# EAGLE design led-panel (EAGLE 9.6.0)

## Sheet 1 of 4
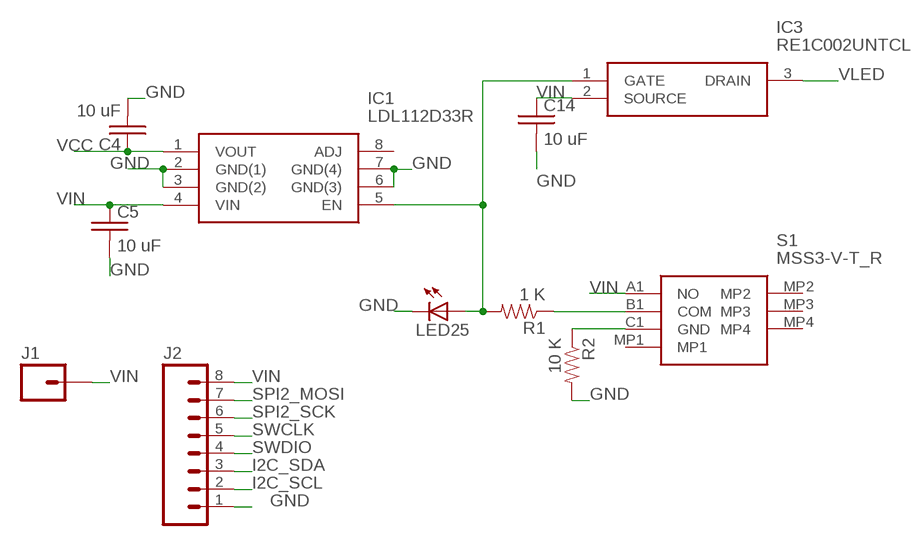
[diagram p0: schematic, sheet 1]

### Parts
C4  10 uF  C-USC0805K  [C0805K]
C5  10 uF  C-USC0805K  [C0805K]
C14  10 uF  C-USC0805K  [C0805K]
IC1  LDL112D33R  [SOIC127P600X175-8N]
IC3  RE1C002UNTCL  [SOT50P160X85-3N]
J1  M01HVIA  [HOME_VIA]
J2  M08LONGPADS  [1X08_LONGPADS]
LED25  LEDXZCFBB53W-8VF-2MA-LED  [LEDC1606X95N]
R1  1 K  RESISTORR0805-RES  [R0805]
R2  10 K  RESISTORR0805-RES  [R0805]
S1  MSS3-V-T_R  [MSS3VTR]

### Nets
GND: C4.2 C5.2 C14.2 IC1.2(GND(1)) IC1.3(GND(2)) IC1.6(GND(3)) IC1.7(GND(4)) J2.1 LED25.2(C) R2.2 ; also sheet 2,3
I2C_SCL: J2.2 ; also sheet 2
I2C_SDA: J2.3 ; also sheet 2
N$9: R2.1 S1.C1(GND)
N$15: R1.1 S1.B1(COM)
N$17: IC1.5(EN) IC3.1(GATE) LED25.1(A) R1.2
SPI2_MOSI: J2.7 ; also sheet 2,3
SPI2_SCK: J2.6 ; also sheet 2,3
SWCLK: J2.5 ; also sheet 2
SWDIO: J2.4 ; also sheet 2
VCC: C4.1 IC1.1(VOUT) ; also sheet 2
VIN: C5.1 C14.1 IC1.4(VIN) IC3.2(SOURCE) J1.1 J2.8 S1.A1(NO)
VLED: IC3.3(DRAIN) ; also sheet 3
Unconnected: IC1.8(ADJ) S1.MP1 S1.MP2 S1.MP3 S1.MP4

## Sheet 2 of 4
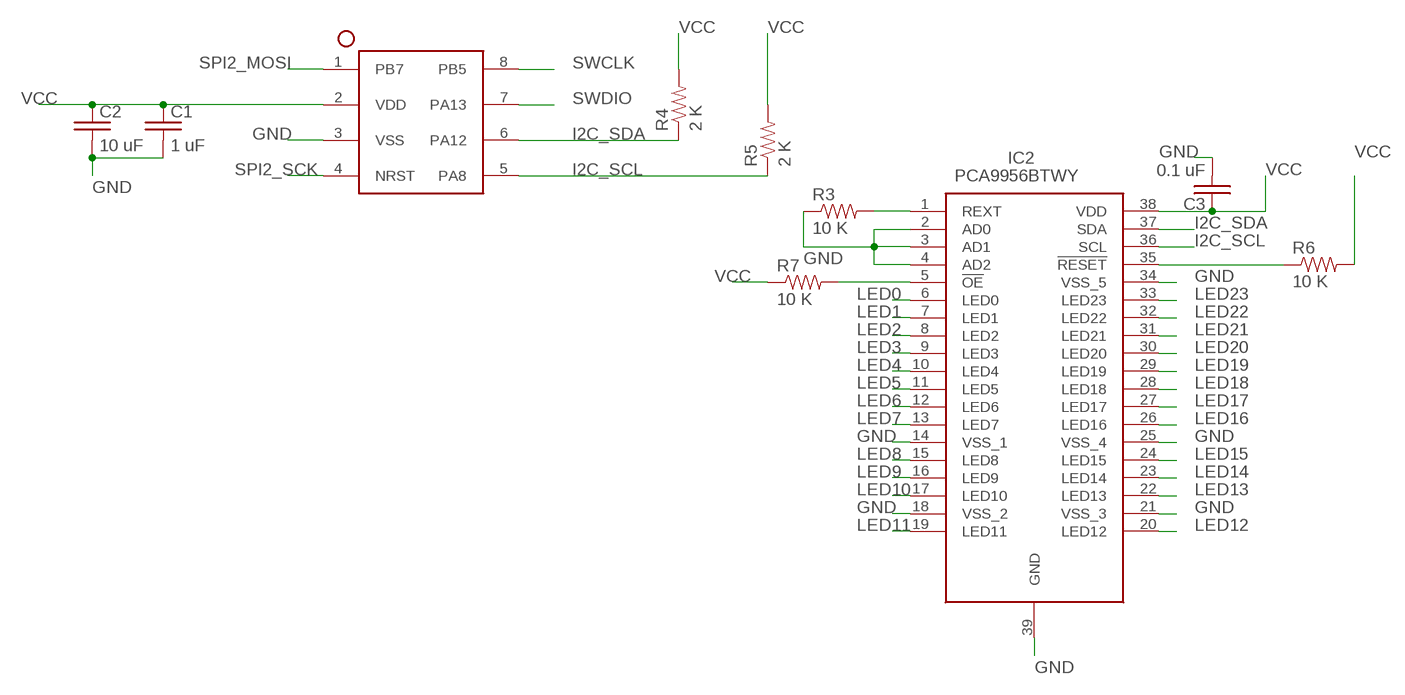
[diagram p1: schematic, sheet 2]

### Parts
C1  1 uF  C-USC0805K  [C0805K]
C2  10 uF  C-USC0805K  [C0805K]
C3  0.1 uF  C-USC0805K  [C0805K]
IC2  PCA9956BTWY  [SOP50P640X110-39N]
R3  10 K  RESISTOR0805-RES  [0805]
R4  2 K  RESISTOR0805-RES  [0805]
R5  2 K  RESISTOR0805-RES  [0805]
R6  10 K  RESISTOR0805-RES  [0805]
R7  10 K  RESISTOR0805-RES  [0805]
U$1  STM32G031S08N  [SOIC127P600X175-8N]

### Nets
GND: C1.2 C2.2 C3.2 IC2.2(AD0) IC2.3(AD1) IC2.4(AD2) IC2.14(VSS_1) IC2.18(VSS_2) IC2.21(VSS_3) IC2.25(VSS_4) IC2.34(VSS_5) IC2.39(GND) R3.1 U$1.3(VSS) ; also sheet 1,3
I2C_SCL: IC2.36(SCL) R5.1 U$1.5(PA8) ; also sheet 1
I2C_SDA: IC2.37(SDA) R4.1 U$1.6(PA12) ; also sheet 1
LED0: IC2.6(LED0) ; also sheet 3
LED1: IC2.7(LED1) ; also sheet 3
LED2: IC2.8(LED2) ; also sheet 3
LED3: IC2.9(LED3) ; also sheet 3
LED4: IC2.10(LED4) ; also sheet 3
LED5: IC2.11(LED5) ; also sheet 3
LED6: IC2.12(LED6) ; also sheet 3
LED7: IC2.13(LED7) ; also sheet 3
LED8: IC2.15(LED8) ; also sheet 3
LED9: IC2.16(LED9) ; also sheet 3
LED10: IC2.17(LED10) ; also sheet 3
LED11: IC2.19(LED11) ; also sheet 3
LED12: IC2.20(LED12) ; also sheet 3
LED13: IC2.22(LED13) ; also sheet 3
LED14: IC2.23(LED14) ; also sheet 3
LED15: IC2.24(LED15) ; also sheet 3
LED16: IC2.26(LED16) ; also sheet 3
LED17: IC2.27(LED17) ; also sheet 3
LED18: IC2.28(LED18) ; also sheet 3
LED19: IC2.29(LED19) ; also sheet 3
LED20: IC2.30(LED20) ; also sheet 3
LED21: IC2.31(LED21) ; also sheet 3
LED22: IC2.32(LED22) ; also sheet 3
LED23: IC2.33(LED23) ; also sheet 3
N$11: IC2.1(REXT) R3.2
N$12: IC2.5(!OE) R7.2
N$44: IC2.35(!RESET) R6.1
SPI2_MOSI: U$1.1(PB7) ; also sheet 1,3
SPI2_SCK: U$1.4(NRST) ; also sheet 1,3
SWCLK: U$1.8(PB5) ; also sheet 1
SWDIO: U$1.7(PA13) ; also sheet 1
VCC: C1.1 C2.1 C3.1 IC2.38(VDD) R4.2 R5.2 R6.2 R7.1 U$1.2(VDD) ; also sheet 1

## Sheet 3 of 4
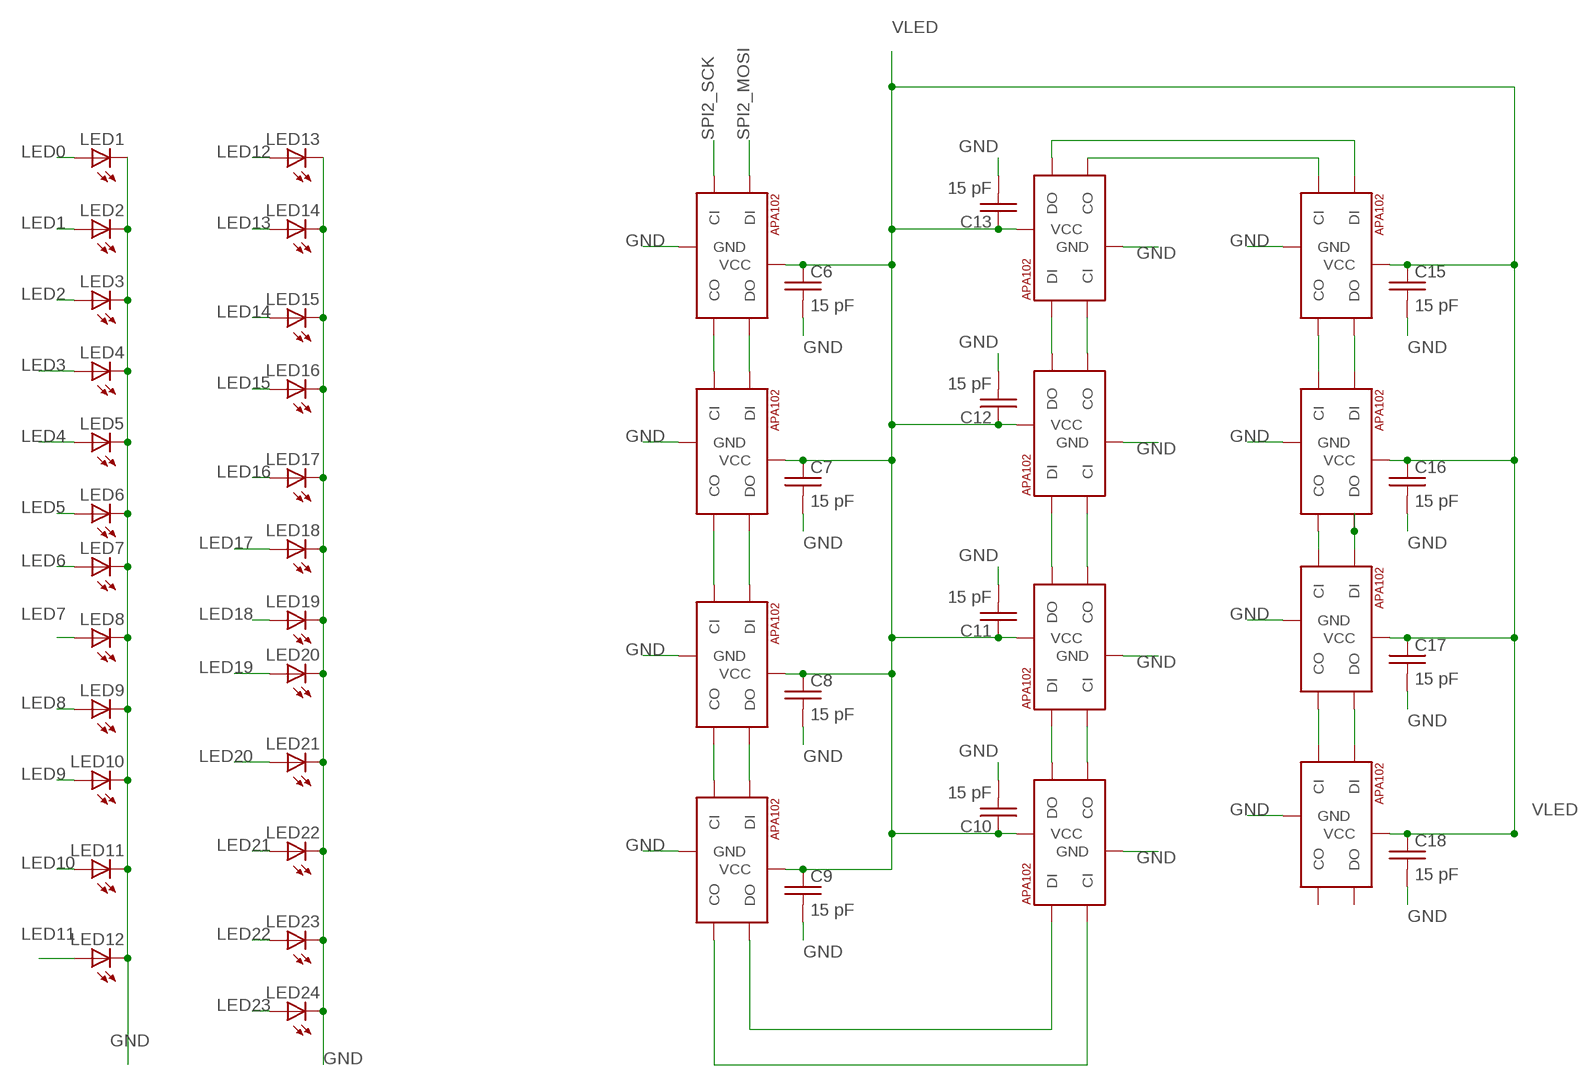
[diagram p2: schematic, sheet 3]

### Parts
C6  15 pF  C-USC0805K  [C0805K]
C7  15 pF  C-USC0805K  [C0805K]
C8  15 pF  C-USC0805K  [C0805K]
C9  15 pF  C-USC0805K  [C0805K]
C10  15 pF  C-USC0805K  [C0805K]
C11  15 pF  C-USC0805K  [C0805K]
C12  15 pF  C-USC0805K  [C0805K]
C13  15 pF  C-USC0805K  [C0805K]
C15  15 pF  C-USC0805K  [C0805K]
C16  15 pF  C-USC0805K  [C0805K]
C17  15 pF  C-USC0805K  [C0805K]
C18  15 pF  C-USC0805K  [C0805K]
LED1  LEDXZCFBB53W-8VF-2MA-LED  [LEDC1606X95N]
LED2  LEDXZCFBB53W-8VF-2MA-LED  [LEDC1606X95N]
LED3  LEDXZCFBB53W-8VF-2MA-LED  [LEDC1606X95N]
LED4  LEDXZCFBB53W-8VF-2MA-LED  [LEDC1606X95N]
LED5  LEDXZCFBB53W-8VF-2MA-LED  [LEDC1606X95N]
LED6  LEDXZCFBB53W-8VF-2MA-LED  [LEDC1606X95N]
LED7  LEDXZCFBB53W-8VF-2MA-LED  [LEDC1606X95N]
LED8  LEDXZCFBB53W-8VF-2MA-LED  [LEDC1606X95N]
LED9  LEDXZCFBB53W-8VF-2MA-LED  [LEDC1606X95N]
LED10  LEDXZCFBB53W-8VF-2MA-LED  [LEDC1606X95N]
LED11  LEDXZCFBB53W-8VF-2MA-LED  [LEDC1606X95N]
LED12  LEDXZCFBB53W-8VF-2MA-LED  [LEDC1606X95N]
LED13  LEDXZCFBB53W-8VF-2MA-LED  [LEDC1606X95N]
LED14  LEDXZCFBB53W-8VF-2MA-LED  [LEDC1606X95N]
LED15  LEDXZCFBB53W-8VF-2MA-LED  [LEDC1606X95N]
LED16  LEDXZCFBB53W-8VF-2MA-LED  [LEDC1606X95N]
LED17  LEDXZCFBB53W-8VF-2MA-LED  [LEDC1606X95N]
LED18  LEDXZCFBB53W-8VF-2MA-LED  [LEDC1606X95N]
LED19  LEDXZCFBB53W-8VF-2MA-LED  [LEDC1606X95N]
LED20  LEDXZCFBB53W-8VF-2MA-LED  [LEDC1606X95N]
LED21  LEDXZCFBB53W-8VF-2MA-LED  [LEDC1606X95N]
LED22  LEDXZCFBB53W-8VF-2MA-LED  [LEDC1606X95N]
LED23  LEDXZCFBB53W-8VF-2MA-LED  [LEDC1606X95N]
LED24  LEDXZCFBB53W-8VF-2MA-LED  [LEDC1606X95N]
U$2  APA1025050  [APA102_5050]
U$4  APA1025050  [APA102_5050]
U$5  APA1025050  [APA102_5050]
U$6  APA1025050  [APA102_5050]
U$7  APA1025050  [APA102_5050]
U$8  APA1025050  [APA102_5050]
U$9  APA1025050  [APA102_5050]
U$10  APA1025050  [APA102_5050]
U$11  APA1025050  [APA102_5050]
U$12  APA1025050  [APA102_5050]
U$13  APA1025050  [APA102_5050]
U$14  APA1025050  [APA102_5050]

### Nets
GND: C6.2 C7.2 C8.2 C9.2 C10.2 C11.2 C12.2 C13.2 C15.2 C16.2 C17.2 C18.2 LED1.2(C) LED2.2(C) LED3.2(C) LED4.2(C) LED5.2(C) LED6.2(C) LED7.2(C) LED8.2(C) LED9.2(C) LED10.2(C) LED11.2(C) LED12.2(C) LED13.2(C) LED14.2(C) LED15.2(C) LED16.2(C) LED17.2(C) LED18.2(C) LED19.2(C) LED20.2(C) LED21.2(C) LED22.2(C) LED23.2(C) LED24.2(C) U$2.6(GND) U$4.6(GND) U$5.6(GND) U$6.6(GND) U$7.6(GND) U$8.6(GND) U$9.6(GND) U$10.6(GND) U$11.6(GND) U$12.6(GND) U$13.6(GND) U$14.6(GND) ; also sheet 1,2
LED0: LED1.1(A) ; also sheet 2
LED1: LED2.1(A) ; also sheet 2
LED2: LED3.1(A) ; also sheet 2
LED3: LED4.1(A) ; also sheet 2
LED4: LED5.1(A) ; also sheet 2
LED5: LED6.1(A) ; also sheet 2
LED6: LED7.1(A) ; also sheet 2
LED7: LED8.1(A) ; also sheet 2
LED8: LED9.1(A) ; also sheet 2
LED9: LED10.1(A) ; also sheet 2
LED10: LED11.1(A) ; also sheet 2
LED11: LED12.1(A) ; also sheet 2
LED12: LED13.1(A) ; also sheet 2
LED13: LED14.1(A) ; also sheet 2
LED14: LED15.1(A) ; also sheet 2
LED15: LED16.1(A) ; also sheet 2
LED16: LED17.1(A) ; also sheet 2
LED17: LED18.1(A) ; also sheet 2
LED18: LED19.1(A) ; also sheet 2
LED19: LED20.1(A) ; also sheet 2
LED20: LED21.1(A) ; also sheet 2
LED21: LED22.1(A) ; also sheet 2
LED22: LED23.1(A) ; also sheet 2
LED23: LED24.1(A) ; also sheet 2
N$1: U$2.2(CO) U$4.5(CI)
N$2: U$2.3(DO) U$4.4(DI)
N$3: U$4.2(CO) U$5.5(CI)
N$4: U$4.3(DO) U$5.4(DI)
N$5: U$5.3(DO) U$6.4(DI)
N$6: U$5.2(CO) U$6.5(CI)
N$7: U$6.3(DO) U$7.4(DI)
N$8: U$6.2(CO) U$7.5(CI)
N$10: U$7.3(DO) U$8.4(DI)
N$13: U$7.2(CO) U$8.5(CI)
N$14: U$8.3(DO) U$9.4(DI)
N$16: U$8.2(CO) U$9.5(CI)
N$18: U$9.2(CO) U$10.5(CI)
N$19: U$9.3(DO) U$10.4(DI)
N$20: U$11.3(DO) U$12.4(DI)
N$21: U$11.2(CO) U$12.5(CI)
N$22: U$13.3(DO) U$14.4(DI)
N$23: U$13.2(CO) U$14.5(CI)
N$24: U$12.2(CO) U$13.5(CI)
N$25: U$12.3(DO) U$13.4(DI)
N$26: U$10.2(CO) U$11.5(CI)
N$27: U$10.3(DO) U$11.4(DI)
SPI2_MOSI: U$2.4(DI) ; also sheet 1,2
SPI2_SCK: U$2.5(CI) ; also sheet 1,2
VLED: C6.1 C7.1 C8.1 C9.1 C10.1 C11.1 C12.1 C13.1 C15.1 C16.1 C17.1 C18.1 U$2.1(VCC) U$4.1(VCC) U$5.1(VCC) U$6.1(VCC) U$7.1(VCC) U$8.1(VCC) U$9.1(VCC) U$10.1(VCC) U$11.1(VCC) U$12.1(VCC) U$13.1(VCC) U$14.1(VCC) ; also sheet 1
Unconnected: U$14.2(CO) U$14.3(DO)

## Sheet 4 of 4
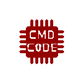
[diagram p3: schematic, sheet 4]

### Parts
U$3  CMD_C0DE_LOGOCMD_CODE_LOGO_TOP_COPPER  [CMD_C0DE_LOGO_TOP_COPPER]

## Library data of the parts
C1-C18 = passives:C-US: CAPACITOR, American symbol
IC1 = voltage-regulator:LDL112D33R: LDO Voltage Regulators 1.2 A low quiescent current LDO with reverse current protection Source: Datasheet <https://www.arrow.com/en/products/ldl112d33r/stmicroelectronics>; ARROW_PART_NUMBER: LDL112D33R; ARROW_PRICE/STOCK: https://www.arrow.com/en/products/ldl112d33r/stmicroelectronics; DESCRIPTION: LDO Voltage Regulators 1.2 A low quiescent current LDO with reverse current protection; HEIGHT: 1.75mm; MANUFACTURER_NAME: STMicroelectronics; MANUFACTURER_PART_NUMBER: LDL112D33R
IC2 = leds:PCA9956BTWY: NXP - PCA9956BTWY - LED DRIVER, CONSTANT CURRENT, HTSSOP-38 Source: Datasheet <https://www.mouser.be/datasheet/2/302/PCA9956B-1127643.pdf>; DESCRIPTION: NXP - PCA9956BTWY - LED DRIVER, CONSTANT CURRENT, HTSSOP-38; HEIGHT: 1.1mm; MANUFACTURER_NAME: NXP; MANUFACTURER_PART_NUMBER: PCA9956BTWY; MOUSER_PART_NUMBER: 771-PCA9956BTWY
IC3 = transitors:RE1C002UNTCL: MOSFET 1.2V Drive Nch MOSFET Source: Datasheet <https://componentsearchengine.com/Datasheets/1/RE1C002UNTCL.pdf>; DESCRIPTION: MOSFET 1.2V Drive Nch MOSFET; HEIGHT: 0.85mm; MANUFACTURER_NAME: ROHM Semiconductor; MANUFACTURER_PART_NUMBER: RE1C002UNTCL; MOUSER_PART_NUMBER: 755-RE1C002UNTCL; MOUSER_PRICE-STOCK: https://www.mouser.com/Search/Refine.aspx?Keyword=755-RE1C002UNTCL
J1 = connector:M01: Header 1 Standard 1-pin 0.1" header. Use with straight break away headers (SKU : PRT-00116), right angle break away headers (PRT-00553), swiss pins (PRT-00743), machine pins (PRT-00117), and female headers (PRT-00115). SMTSO-256-ET is a "flush mount" nut for a 4-40 screw. The older package used to be too tight, and did not allow it to sit properly thru the drill hit. The latest (0.165DIA) fits nice and snug.
J2 = connector:M08: Header 8 Standard 8-pin 0.1" header. Use with straight break away headers (SKU : PRT-00116), right angle break away headers (PRT-00553), swiss pins (PRT-00743), machine pins (PRT-00117), and female headers (PRT-00115).
LED1-LED25 = leds:LED: LEDs Standard schematic elements and footprints for 5mm, 3mm, 1206, and 0603 sized LEDs. 5mm - Spark Fun Electronics SKU : COM-00529 (and others)
R1-R7 = passives:RESISTOR: Resistor Basic schematic elements and footprints for 0603, 1206, and PTH resistors.
S1 = switches:MSS3-V-T_R: Slide Switches Slide Type 1P2T (1.4mm height) Source: Datasheet <http://www.dip.com.tw/en/en-product-information/en-switch005/item/download/2643_3624e6da26abd0f9c3465d69564276ea>; DESCRIPTION: Slide Switches Slide Type 1P2T (1.4mm height); HEIGHT: 1.4mm; MANUFACTURER_NAME: Diptronics; MANUFACTURER_PART_NUMBER: MSS3-V-T/R; MOUSER_PART_NUMBER: 113-MSS3-V-T/R; MOUSER_PRICE-STOCK: https://www.mouser.com/Search/Refine.aspx?Keyword=113-MSS3-V-T%2FR
U$1 = ICs:STM32G031
U$2 U$4-U$14 = leds:APA102: APA102C 5050 RGB LED -- Adafruit DotStar Single LED Pixel Product Page: https://www.adafruit.com/products/2343 Datasheet: https://cdn-shop.adafruit.com/product-files/2343/APA102C.pdf
U$3 = logos:CMD_C0DE_LOGO

## Board
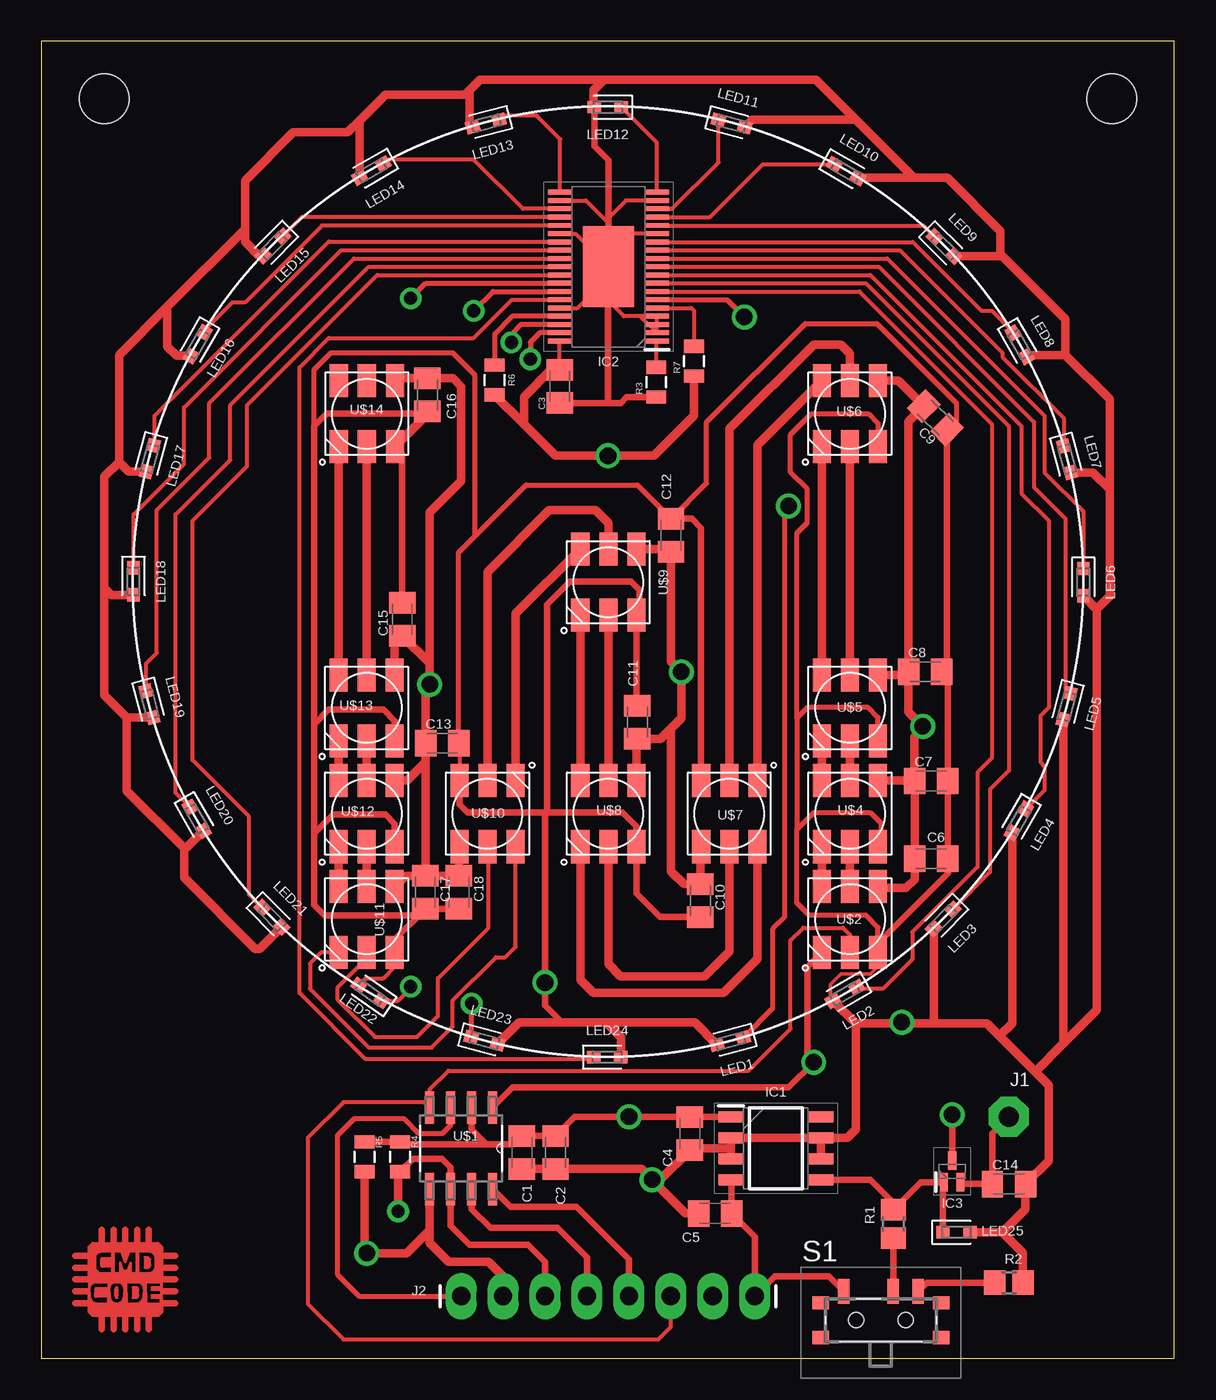
[diagram p4: board, top side]
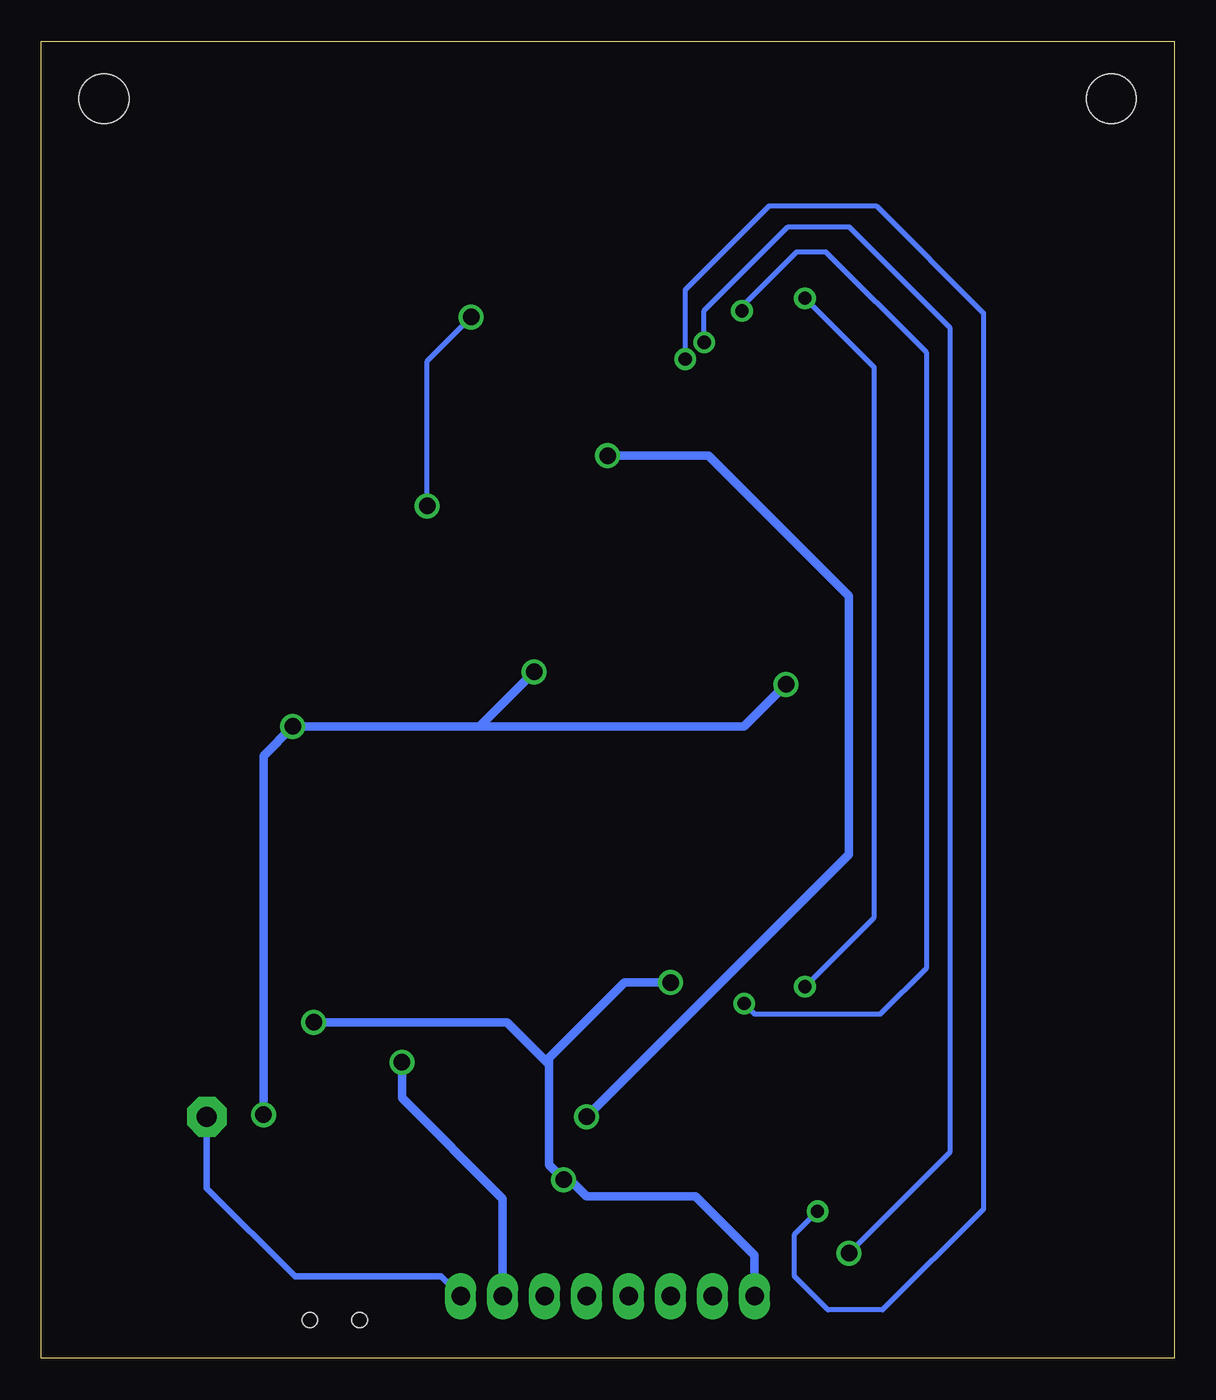
[diagram p5: board, bottom side, seen from below]

Size 68.56 x 79.68 mm. Coordinates in mm from the lower left corner, seen from the top.
Outline: 0,0 68.56,0 68.56,79.68 0,79.68 0,0
Copper layers (1*16): Top 0.035mm / dielectric 1.5mm / Bottom 0.035mm
Design rules "OthermillDRC_30_deg_v2": minimum track width 6mil, minimum drill 0.8mm, track to track 6mil, track to pad 6mil, pad to pad 6mil, via to via 6mil, smd to smd 0mil, copper to edge 0mil, drill to drill 6mil, minimum pad ring 10mil, minimum via ring 10mil, stop-mask expansion 1mil, vias tented up to drill 30mil, thermal gap 6mil
Holes 3 mm at 3.81,76.2 64.77,76.2

### Footprints (pad centres in the part's own frame; a part is rotated, then mirrored left to right if it is on the bottom)
C0805K = smd 1.3 x 1.6: 1 -1,0; 2 1,0
SOIC127P600X175-8N = smd 1.525 x 0.65: 1 -2.712,1.905; 2 -2.712,0.635; 3 -2.712,-0.635; 4 -2.712,-1.905; 5 2.712,-1.905; 6 2.712,-0.635; 7 2.712,0.635; 8 2.712,1.905
SOP50P640X110-39N = smd 1.45 x 0.3: 1 -2.925,4.5; 2 -2.925,4; 3 -2.925,3.5; 4 -2.925,3; 5 -2.925,2.5; 6 -2.925,2; 7 -2.925,1.5; 8 -2.925,1; 9 -2.925,0.5; 10 -2.925,0; 11 -2.925,-0.5; 12 -2.925,-1; 13 -2.925,-1.5; 14 -2.925,-2; 15 -2.925,-2.5; 16 -2.925,-3; 17 -2.925,-3.5; 18 -2.925,-4; 19 -2.925,-4.5; 20 2.925,-4.5; 21 2.925,-4; 22 2.925,-3.5; 23 2.925,-3; 24 2.925,-2.5; 25 2.925,-2; 26 2.925,-1.5; 27 2.925,-1; 28 2.925,-0.5; 29 2.925,0; 30 2.925,0.5; 31 2.925,1; 32 2.925,1.5; 33 2.925,2; 34 2.925,2.5; 35 2.925,3; 36 2.925,3.5; 37 2.925,4; 38 2.925,4.5 | smd 3.1 x 4.9: 39 0,0
SOT50P160X85-3N = smd 1.1 x 0.5: 1 -0.65,0.5; 2 -0.65,-0.5; 3 0.65,0
HOME_VIA = drill 1.2 pad 2.4 octagon: 1 0,0
1X08_LONGPADS = drill 1.118 pad 1.88 long: 1 0,0; 2 2.54,0; 3 5.08,0; 4 7.62,0; 5 10.16,0; 6 12.7,0; 7 15.24,0; 8 17.78,0
LEDC1606X95N = smd 0.81 x 0.75: 1 -0.82,0; 2 0.82,0
R0805 = smd 1.3 x 1.5: 1 -0.85,0; 2 0.85,0
0805 = smd 0.8 x 1.2: 1 -0.9,0; 2 0.9,0
MSS3VTR = smd 0.7 x 1.5: A1 -2.25,3.05; B1 0.75,3.05; C1 2.25,3.05 | smd 1 x 0.8: MP1 -3.65,2.35; MP2 -3.65,0.25; MP3 3.65,0.25; MP4 3.65,2.35 | hole 0.9: -1.5,1.3; 1.5,1.3
SOIC127P600X175-8N' = smd 1.981 x 0.559: 1 -2.464,1.905; 2 -2.464,0.635; 3 -2.464,-0.635; 4 -2.464,-1.905; 5 2.464,-1.905; 6 2.464,-0.635; 7 2.464,0.635; 8 2.464,1.905
APA102_5050 = smd 2 x 1.1: 1 2,-1.7; 2 2,0; 3 2,1.7; 4 -2,1.7; 5 -2,0; 6 -2,-1.7

### Placement (x,y rotation side)
C1  29.08,12.45 270 top
C2  31.11,12.45 270 top
C3  31.37,58.8 270 top
C4  39.24,13.59 270 top
C5  40.77,8.76 180 top
C6  53.85,30.23 0 top
C7  53.85,34.92 0 top
C8  53.47,41.53 0 top
C9  54.1,56.9 315 top
C10  39.88,27.69 270 top
C11  36.07,38.48 90 top
C12  38.1,49.78 90 top
C13  24.26,37.21 0 top
C14  58.55,10.54 0 top
C15  21.84,44.7 90 top
C16  23.37,58.29 270 top
C17  23.24,28.19 270 top
C18  25.27,28.19 270 top
IC1  44.45,12.7 0 top
IC2  34.31,66.04 180 top
IC3  55.12,11.3 90 top
J1  58.55,14.61 0 top
J2  25.4,3.75 0 top
LED1  41.68,19.18 195 top
LED2  48.62,22.03 210 top
LED3  54.58,26.58 225 top
LED4  59.16,32.52 240 top
LED5  62.05,39.44 255 top
LED6  63.05,46.96 270 top
LED7  62.07,54.39 285 top
LED8  59.2,61.32 300 top
LED9  54.64,67.27 315 top
LED10  48.7,71.83 330 top
LED11  41.77,74.7 345 top
LED12  34.28,75.69 180 top
LED13  26.9,74.72 195 top
LED14  19.97,71.86 210 top
LED15  14.02,67.3 225 top
LED16  9.45,61.36 240 top
LED17  6.57,54.43 255 top
LED18  5.58,47 270 top
LED19  6.55,39.57 285 top
LED20  9.4,32.63 300 top
LED21  13.96,26.67 315 top
LED22  19.89,22.1 145 top
LED23  26.82,19.22 345 top
LED24  34.25,18.22 0 top
LED25  55.37,7.62 0 top
R1  51.56,8.13 90 top
R2  58.55,4.57 0 top
R3  37.21,59.05 90 top
R4  21.72,12.19 90 top
R5  19.56,12.19 90 top
R6  27.43,59.18 270 top
R7  39.5,60.33 90 top
S1  50.8,1 0 top
U$1  STM32G031S08N  [SOIC127P600X175-8N']  25.4,12.7 270 top
U$2  48.93,26.55 90 top
U$3  5.08,5.08 0 top
U$4  48.93,32.95 90 top
U$5  48.93,39.34 90 top
U$6  48.93,57.15 90 top
U$7  41.63,32.95 270 top
U$8  34.31,32.95 90 top
U$9  34.31,46.96 90 top
U$10  27,32.95 270 top
U$11  19.68,26.55 90 top
U$12  19.68,32.95 90 top
U$13  19.68,39.34 90 top
U$14  19.7,57.15 90 top

### Tracks (layer width: path | path; a pad name or v marks a point on that pad's centre or on a via)
GND  (via drill 1)
  Top 0.2: LED2.2 47.75,21.78 47.75,22.61 48.39,23.24 49.45,23.24 49.46,23.24 50.16,23.24 50.63,23.71 U$2.6
  Top 0.254: 36.24,63.04 IC2.4 IC2.3 IC2.2 36.24,63.04 | 36.24,63.04 35.26,63.04 34.31,63.98 34.31,65.02 34.31,65.41 | 34.31,65.41 IC2.39 | IC2.34 32.45,63.54 34.31,65.41 | IC2.25 32.31,68.04 IC2.39 | IC2.14 35.59,68.04 35.56,68.07 34.31,66.83 IC2.39 | IC2.21 32.96,70.04 34.31,68.68 | 34.31,68.68 IC2.39 | IC2.18 35.37,70.04 34.31,68.99 34.31,68.68 | 50.8,31.12 U$4.6 | C11.2 36.02,39.53 | U$9.6 36.02,44.83 36.2,45.01 | C17.2 22.84,26.8 | 23.34,57.15 23.37,57.12 | C13.2 25.3,37.17 U$10.6 | 38.12,50.8 C12.2 | 30.61,33.15 30.48,33.02 | LED22.2 19.64,22.99 20.7,22.99 21.39,23.67 U$11.6
  Top 0.305: U$2.6 50.63,26.08 49.91,26.8 46.48,26.8 45.72,27.56 45.72,32 | 45.72,32 46.74,33.02 50.16,33.02 50.8,32.38 50.8,31.12 | U$5.6 50.63,38.78 50.04,39.37 46.35,39.37 45.72,38.73 | 45.72,38.73 45.72,32 | 45.72,38.73 45.72,49.91 46.35,50.55 46.35,52.58 45.34,53.59 45.34,55.88 46.61,57.15 50.04,57.15 50.63,56.56 U$6.6 | U$1.3 24.77,14.1 24.26,13.59 22.86,13.59 21.97,14.48 18.92,14.48 17.91,13.46 17.91,5.08 19.24,3.75 J2.1 | C13.2 25.26,48.75 26.23,49.72 | 26.23,49.72 29.34,52.83 36.07,52.83 38.1,50.8 C12.2 40.26,52.94 40.26,56.64 46.23,62.61 50.55,62.61 55.37,57.78 55.37,56.75 C9.2 | 16.51,56.39 16.51,59.82 17.53,60.83 24.89,60.83 26.23,59.5 26.23,49.72
  Top 0.406: C9.2 54.81,41.87 C8.2 54.85,41.15 C7.2 C6.2 54.85,29.32 50.63,25.1 U$2.6 | C3.2 34.29,57.8 | 34.29,57.8 35.07,57.8 35.42,58.16 R3.1 | 34.29,57.8 34.29,65 34.31,65.02 | C10.2 37.45,26.69 36.02,28.12 U$8.6 36.02,32.18 35.18,33.02 30.48,33.02 | 36.02,39.53 36.02,44.83 | C18.2 C17.2 21.39,25.34 U$11.6 | 22.84,26.8 17.14,26.8 16.51,27.43 16.51,31.75 | U$12.6 21.39,32.34 20.83,32.89 17.65,32.89 16.51,31.75 | 16.51,31.75 16.51,38.35 | 16.51,38.35 17.4,39.24 20.7,39.24 21.39,38.56 U$13.6 | 16.51,38.35 16.51,56.39 17.27,57.15 23.34,57.15 | C15.2 21.84,54.71 U$14.6 | U$10.6 25.3,33.5 25.78,33.02 30.48,33.02 | U$7.6 39.93,50.24 39.37,50.8 38.12,50.8 | 36.2,45.01 36.2,46.48 35.69,46.99 32,46.99 30.61,45.59 30.61,33.15 | IC2.39 34.31,72.49 33.46,73.35 LED12.2 | 30.48,33.02 30.48,21.34 31.5,20.32
  Top 0.508: C1.2 C2.2 36.31,11.45 v36.96,10.79 | IC1.3 41.74,12.7 | 41.74,12.7 IC1.2 IC1.7 | 41.74,12.7 39.35,12.7 C4.2 37.45,10.79 v36.96,10.79 | IC1.6 IC1.7 | IC1.7 48.77,13.34 49.28,13.84 49.28,20.25 | 49.28,20.25 LED2.2 | LED25.2 58.17,7.62 | R2.2 59.4,6.39 58.17,7.62 | 58.17,7.62 59.55,9 C14.2 60.96,11.95 60.96,16.51 60.13,17.34 | 60.13,17.34 57.98,19.49 | 57.98,19.49 57.22,20.25 53.85,20.25 | 53.85,20.25 49.28,20.25 | LED3.2 54,20.4 53.85,20.25 | LED4.2 58.75,20.27 57.98,19.49 | LED5.2 61.84,19.04 | 61.84,19.04 60.13,17.34 | LED6.2 63.88,45.31 | 61.84,19.04 63.88,21.08 63.88,45.31 | 63.88,45.31 63.88,45.34 64.64,46.1 64.64,52.58 | LED7.2 63.62,53.6 64.64,52.58 | 61.98,60.71 64.64,58.04 64.64,52.58 | 61.98,60.71 59.71,60.71 LED8.2 | 61.98,60.71 61.98,62.87 58.15,66.69 | 58.15,66.69 LED9.2 | 58.15,66.69 58.04,66.8 58.04,68.2 54.82,71.42 52.79,71.42 | 52.79,71.42 LED10.2 | 52.79,71.42 49.28,74.93 | 49.28,74.93 43,74.93 LED11.2 | LED12.2 33.4,75.75 33.4,76.71 34.04,77.34 | 49.28,74.93 46.86,77.34 34.04,77.34 | 34.04,77.34 26.54,77.34 25.91,76.71 | 25.91,76.71 25.91,74.71 LED13.2 | 25.91,76.71 25.65,76.45 20.83,76.45 19.26,74.89 | 19.26,74.89 LED14.2 | 19.26,74.89 18.54,74.17 15.24,74.17 12.32,71.25 12.32,68.33 | 12.32,68.33 12.32,67.56 13.16,66.72 LED15.2 | LED16.2 8.19,60.65 7.62,61.21 7.62,63.63 | 7.62,63.63 12.32,68.33 | LED17.2 5.29,53.64 4.7,54.23 | 4.7,54.23 4.7,60.71 7.62,63.63 | LED18.2 4.24,46.18 3.81,46.61 | 3.81,46.61 3.81,53.34 4.7,54.23 | LED19.2 5.17,38.78 | 3.81,46.61 3.81,40.13 5.17,38.78 | LED20.2 8.75,30.86 8.64,30.86 | 8.64,30.86 5.17,34.33 5.17,38.78 | LED21.2 13.21,24.77 12.95,24.77 8.64,29.08 8.64,30.86
  Top 0.508: LED23.2 28.92,20.32 31.5,20.32 34.16,20.32 | LED24.2 35.07,19.42 34.16,20.32 | LED1.2 39.54,20.32 34.16,20.32 | U$14.6 23.37,57.12 C16.2 | C5.2 38.99,8.76 v36.96,10.79
  Bottom 0.508: J2.1 25.4,6.21 28.97,9.78 35.56,9.78 36.58,10.79 v36.96,10.79 37.85,11.68 37.85,17.78 | 37.85,17.78 37.85,18.16 33.27,22.73 v30.48,22.73 | 37.85,17.78 40.39,20.32 v52.07,20.32
I2C_SCL  (via drill 0.8, 1)
  Top 0.305: IC2.36 29.01,62.54 28.45,61.98 v28.45,61.47
  Top 0.508: R5.1 19.56,6.48 v19.68,6.35 22.1,6.35 23.5,7.75 U$1.5 23.5,6.99 24.64,5.84 27.05,5.84 27.94,4.95 J2.2
  Bottom 0.305: v28.45,61.47 28.45,63.37 23.37,68.45 19.68,68.45 13.59,62.36 13.59,12.45 v19.68,6.35
I2C_SDA  (via drill 0.8)
  Top 0.305: IC2.37 30.16,62.04 29.59,61.47 v29.59,60.45 | 21.59,11.16 R4.1
  Top 0.406: R4.1 22.49,12.06 24.26,12.06 24.77,11.56 U$1.6 24.77,8 25.91,6.86 29.46,6.86 30.48,5.84 J2.3
  Top 0.508: v21.59,8.89 21.59,11.16
  Bottom 0.305: v29.59,60.45 29.59,64.64 24.51,69.72 18.03,69.72 11.56,63.25 11.56,9.02 17.65,2.92 20.95,2.92 22.99,4.95 22.99,7.49 v21.59,8.89
LED0  (via drill 1)
  Top 0.305: IC2.6 41.5,64.04 v42.55,62.99 | LED1.1 44.25,21.17 44.25,25.96 44.96,26.67 44.96,51.31 v45.21,51.56
  Bottom 0.305: v45.21,51.56 45.21,60.33 v42.55,62.99
LED1
  Top 0.254: IC2.7 49.51,64.54 57.53,56.52 57.53,36.32 56.64,35.43 56.64,29.72 52.7,25.78 52.7,24.13 50.93,22.35 49.42,22.35 LED2.1
LED2
  Top 0.254: IC2.8 49.9,65.04 58.55,56.39 58.55,35.56 57.4,34.42 57.4,29.41 LED3.1
LED3
  Top 0.254: IC2.9 50.16,65.54 59.31,56.39 59.31,52.32 60.96,50.67 60.96,39.37 60.45,38.86 60.45,36.07 60.71,35.81 60.71,34.36 LED4.1
LED4
  Top 0.254: IC2.10 50.67,66.04 60.07,56.64 60.07,52.7 61.98,50.8 61.98,40.51 LED5.1
LED5
  Top 0.254: IC2.11 51.19,66.54 60.71,57.02 60.71,53.59 63.05,51.25 LED6.1
LED6
  Top 0.254: IC2.12 51.96,67.04 58.17,60.83 58.17,60.58 61.86,56.89 LED7.1
LED7
  Top 0.254: IC2.13 52.73,67.54 56.9,63.37 57.53,63.37 58.79,62.11 LED8.1
LED8
  Top 0.254: IC2.15 53.37,68.54 LED9.1
LED9
  Top 0.254: IC2.16 40.47,69.04 43.67,72.24 LED10.1
LED10
  Top 0.254: IC2.17 38.17,69.54 40.98,72.35 LED11.1
LED11
  Top 0.254: IC2.19 37.24,73.55 LED12.1
LED12
  Top 0.254: IC2.20 31.39,73.77 29.97,75.18 27.95,75.18 LED13.1
LED13
  Top 0.254: IC2.22 29.14,69.54 26.16,72.52 20.93,72.52 LED14.1
LED14
  Top 0.254: IC2.23 15.76,69.04 LED15.1
LED15
  Top 0.254: IC2.24 16.98,68.54 12.32,63.88 11.56,63.88 9.86,62.18 LED16.1
LED16
  Top 0.254: LED17.1 6.86,55.3 6.86,57.02 17.4,67.56 31.37,67.56 IC2.26
LED17
  Top 0.254: LED18.1 5.58,51.05 8.64,54.1 8.64,57.53 18.14,67.04 IC2.27
LED18
  Top 0.254: LED19.1 6.33,42.02 6.99,42.67 6.99,51.31 10.16,54.48 10.16,57.78 18.91,66.54 IC2.28
LED19
  Top 0.254: LED20.1 8.13,34.2 8.13,51.05 11.43,54.36 11.43,57.66 19.81,66.04 IC2.29
LED20
  Top 0.254: LED21.1 12.57,28.06 12.57,32.77 9.14,36.2 9.14,50.67 12.45,53.98 12.45,57.66 20.33,65.54 IC2.30
LED21  (via drill 0.8)
  Top 0.254: v22.35,22.48 22.35,22.4 21.58,21.63 LED22.1
  Top 0.305: v22.35,64.14 23.26,65.04 IC2.31
  Bottom 0.305: v22.35,22.48 18.16,26.67 18.16,59.94 v22.35,64.14
LED22  (via drill 0.8)
  Top 0.305: LED23.1 26.02,21.45 v26.04,21.46 | v26.16,63.37 27.33,64.54 IC2.32
  Bottom 0.305: v26.04,21.46 25.4,20.83 17.78,20.83 14.99,23.62 14.99,60.83 21.08,66.93 22.86,66.93 26.16,63.63 v26.16,63.37
LED23
  Top 0.254: LED24.1 33.3,18.09 19.62,18.09 15.62,22.1 15.62,59.94 17.4,61.72 26.16,61.72 28.48,64.04 IC2.33
N$1
  Top 0.508: U$2.2 U$4.5
N$2
  Top 0.508: U$2.3 U$4.4
N$3
  Top 0.508: U$4.2 U$5.5
N$4
  Top 0.508: U$4.3 U$5.4
N$5
  Top 0.508: U$5.3 U$6.4
N$6
  Top 0.508: U$5.2 U$6.5
N$7
  Top 0.508: U$6.3 43.33,55.25 U$7.4
N$8
  Top 0.508: U$6.2 48.93,60.8 48.39,61.34 46.74,61.34 41.63,56.23 U$7.5
N$9
  Top 0.406: S1.C1 53.57,4.57 R2.1
N$10
  Top 0.508: U$8.4 32.62,22.88 33.4,22.1 41.27,22.1 43.33,24.15 U$7.3
N$11
  Top 0.254: R3.2 37.21,61.51 IC2.1
N$12
  Top 0.254: IC2.5 39.33,63.54 39.5,63.37 R7.2
N$13
  Top 0.508: U$7.2 41.63,24.61 40.13,23.11 35.05,23.11 34.31,23.85 U$8.5
N$14
  Top 0.508: U$8.3 U$9.4
N$15
  Top 0.406: S1.B1 51.55,7.27 R1.1
N$16
  Top 0.508: U$8.2 U$9.5
N$17
  Top 0.406: IC1.5 50.16,10.79 51.56,9.4 R1.2 53.24,10.65 IC3.1 54.55,10.59 LED25.1
N$18
  Top 0.508: U$10.5 27,47.57 30.73,51.31 33.53,51.31 34.31,50.52 U$9.2
N$19
  Top 0.508: U$10.4 28.7,45.04 U$9.3
N$20
  Top 0.508: U$11.3 U$12.4
N$21
  Top 0.508: U$11.2 U$12.5
N$22
  Top 0.508: U$13.3 17.98,55.13 U$14.4
N$23
  Top 0.508: U$13.2 19.68,55.13 U$14.5
N$24
  Top 0.508: U$12.2 U$13.5
N$25
  Top 0.508: U$12.3 U$13.4
N$26
  Top 0.254: U$11.5 19.68,24.18 17.91,22.4 17.91,21.72 20.19,19.43 22.73,19.43 24,20.7 24,22.99 27.05,26.04 27.05,30.9 U$10.2
N$27
  Top 0.254: U$11.4 16.93,24.55 16.26,23.88 16.26,22.35 19.81,18.8 23.62,18.8 24.89,20.07 24.89,21.64 27.51,24.26 28.07,24.26 28.7,24.89 U$10.3
N$44
  Top 0.305: IC2.35 28.5,63.04 27.43,61.98 R6.1
SPI2_MOSI  (via drill 1)
  Top 0.406: U$1.1 28.52,16.38 45.21,16.38 v46.74,17.91 46.35,18.29 46.35,23.68 U$2.4
  Bottom 0.508: J2.7 40.64,9.65 46.74,15.75 v46.74,17.91
SPI2_SCK
  Top 0.254: U$2.5 48.93,25.62 48.51,26.04 46.1,26.04 45.34,25.27 45.34,19.94 42.8,17.4 24.64,17.4 23.5,16.26 U$1.4 23.16,15.49 18.29,15.49 16.13,13.34 16.13,3.3 18.29,1.14 37.34,1.14 38.1,1.91 J2.6
SWCLK
  Top 0.406: U$1.8 28.4,9.14 32.38,9.14 35.56,5.97 J2.5
SWDIO
  Top 0.406: U$1.7 26.04,9.02 27.18,7.87 31.24,7.87 33.02,6.1 J2.4
VCC  (via drill 1)
  Top 0.254: C3.1 31.37,61.52 IC2.38
  Top 0.406: 26.94,12.94 28.57,12.94 C1.1 C2.1 32.27,14.61 v35.56,14.61 39.23,14.61 | U$1.2 26.04,13.84 26.94,12.94 | 26.94,12.94 21.87,12.94 R4.2 R5.2 | 39.23,14.61 C4.1 | IC1.1 39.23,14.61
  Top 0.508: R7.1 39.5,57.02 37.08,54.61 v34.29,54.61 31.11,54.61 29.21,56.52 | 29.21,56.52 29.21,58.17 30.84,59.8 C3.1 | 29.21,56.52 29.2,56.52 R6.2
  Bottom 0.508: v35.56,14.61 19.68,30.48 19.68,46.1 28.19,54.61 v34.29,54.61
VIN
  Top 0.406: S1.A1 47.65,4.95 44.38,4.95 J2.8 43.18,7.35 C5.1 41.77,10.77 IC1.4 | J1.1 57.55,13.61 C14.1 55.73,10.54 IC3.2
  Bottom 0.406: J2.8 44.38,4.95 53.21,4.95 58.55,10.29 J1.1
VLED  (via drill 1)
  Top 0.406: IC3.3 v55.12,14.73
  Top 0.508: C7.1 52.83,34.94 52.83,37.59 53.34,38.1 v53.34,38.23 52.47,39.1 C8.1 | C7.1 52.82,34.95 U$4.1 | C7.1 C6.1 52.85,28.97 52.32,28.45 50.73,28.45 U$2.1 | U$9.1 37.93,48.96 C12.1 38.1,42.16 v38.73,41.53 38.73,38.73 38.1,38.1 | U$8.1 36.02,37.43 C11.1 37.48,37.48 38.1,38.1 | 38.1,38.1 38.1,29.46 38.88,28.69 C10.1 39.88,30.9 U$7.1 | U$10.1 25.27,30.92 C18.1 C17.1 | U$11.1 22.03,29.19 C17.1 | U$12.1 22.12,34.95 23.26,36.08 C13.1 | 23.5,42.05 v23.5,40.77 23.26,40.53 C13.1 | 23.5,42.05 C15.1 21.39,43.24 U$13.1 | 23.5,42.05 23.5,51.18 25.4,53.09 25.4,58.8 24.91,59.29 C16.1 21.54,59.29 U$14.1 | C17.1 23.24,37.2 C13.1 | U$6.1 51.85,59.15 C9.1 52.47,56.67 C8.1 | U$5.1 52.28,41.34 C8.1
  Bottom 0.508: v55.12,14.73 55.12,36.45 v53.34,38.23 42.04,38.23 | 42.04,38.23 v38.73,41.53 | v23.5,40.77 26.04,38.23 42.04,38.23